# EAGLE design emc6907 (EAGLE 6.6.0)
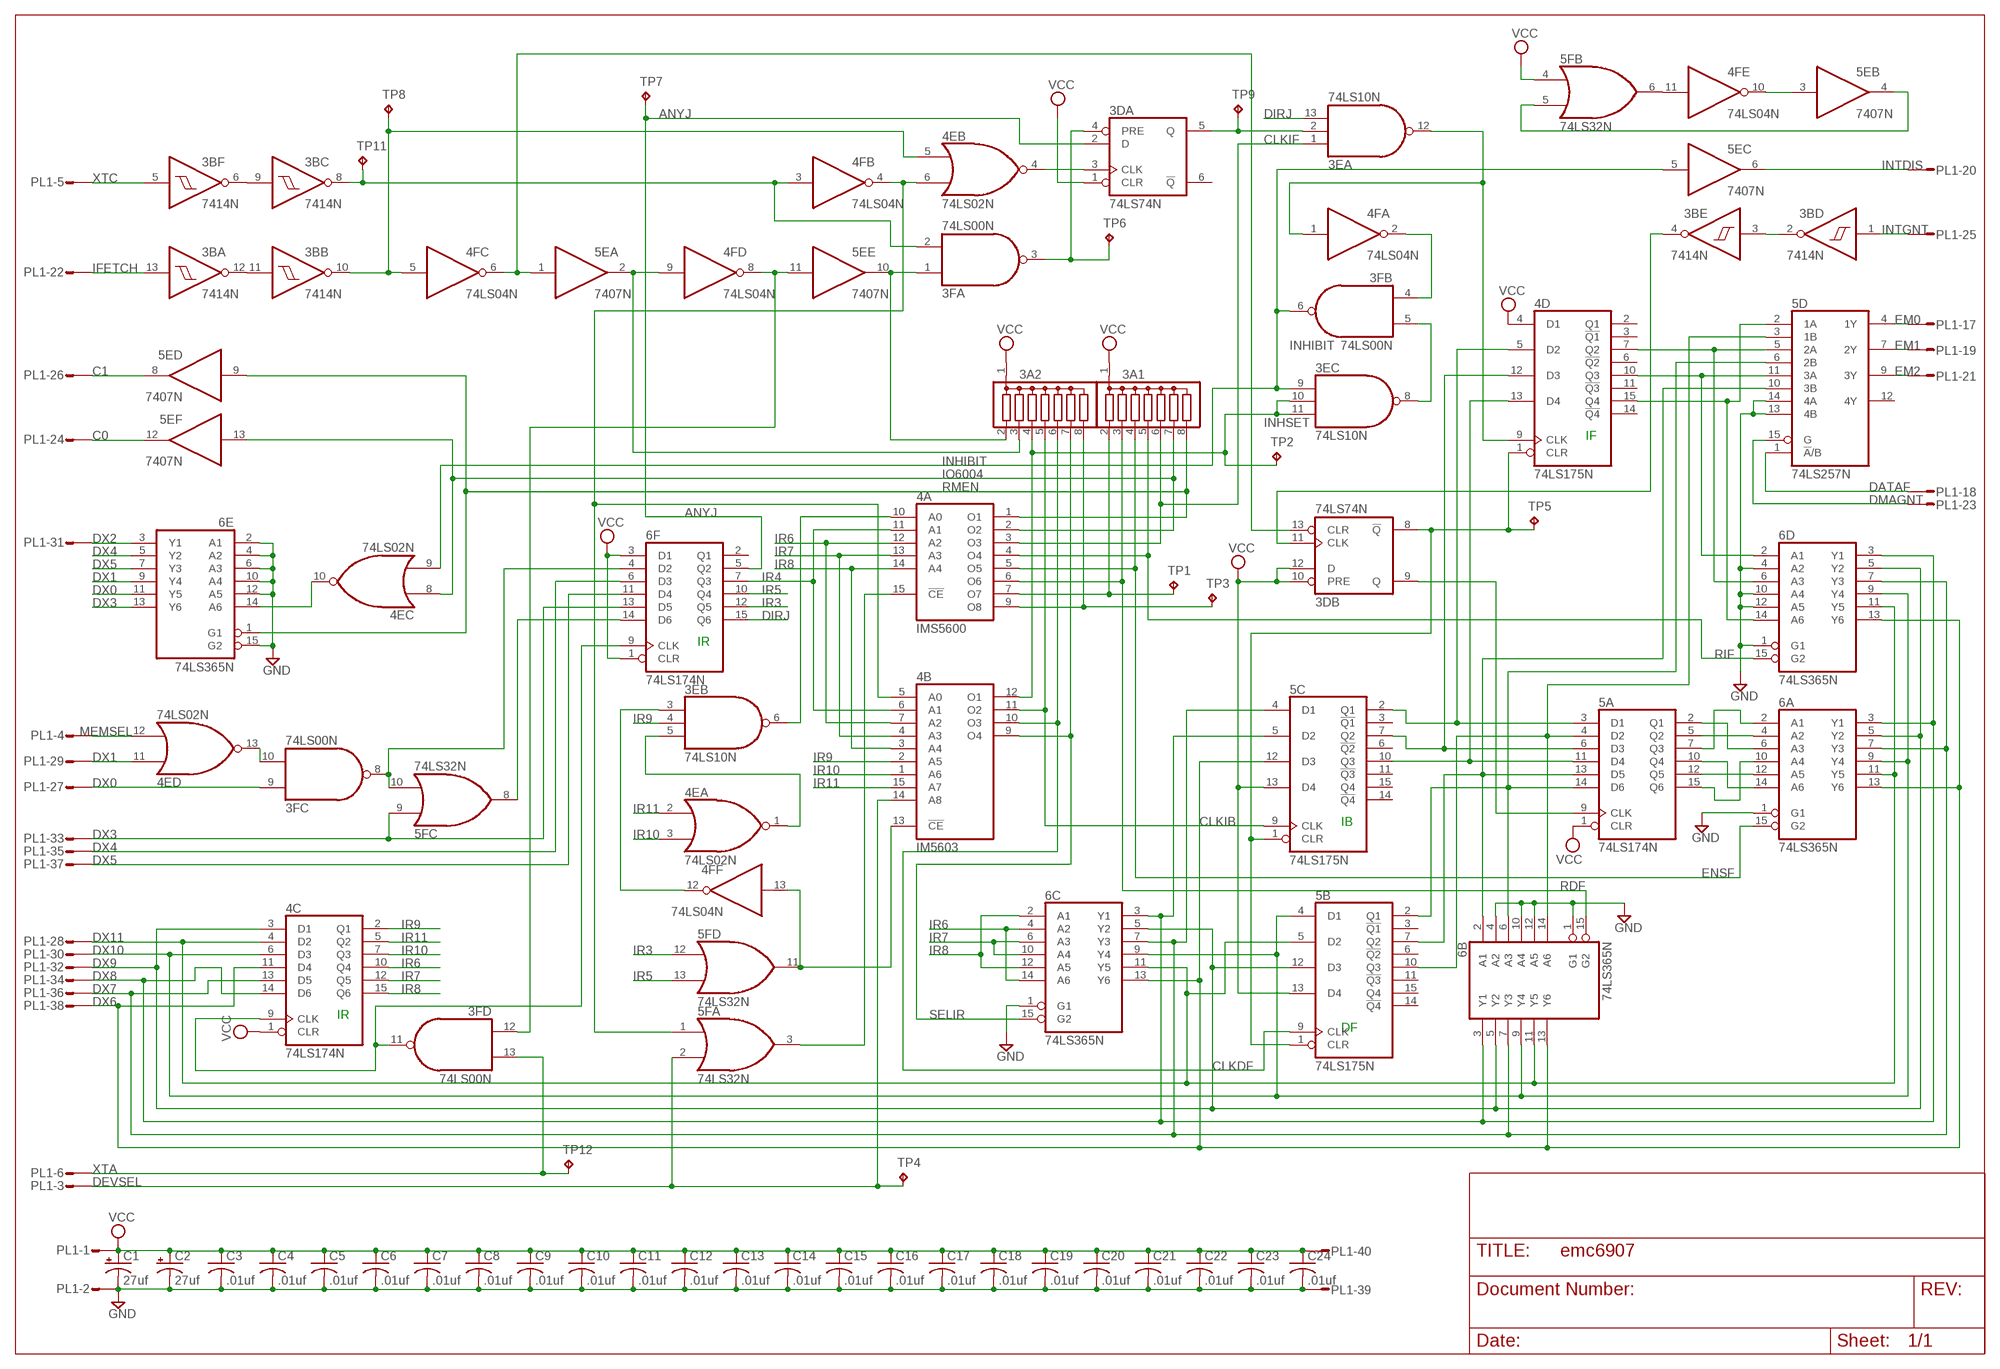
[diagram p0: schematic, sheet 1]

## Parts
3A1  G07R  [SIL8]
3A2  G07R  [SIL8]
3B  7414N  [DIL14]
3D  74LS74N  [DIL14]
3E  74LS10N  [DIL14]
3F  74LS00N  [DIL14]
4A  IMS5600  5600  [DIL16]
4B  IM5603  5306  [DIL16]
4C  74LS174N  [DIL16]
4D  74LS175N  [DIL16]
4E  74LS02N  [DIL14]
4F  74LS04N  [DIL14]
5A  74LS174N  [DIL16]
5B  74LS175N  [DIL16]
5C  74LS175N  [DIL16]
5D  74LS257N  [DIL16]
5E  7407N  [DIL14]
5F  74LS32N  [DIL14]
6A  74LS365N  [DIL16]
6B  74LS365N  [DIL16]
6C  74LS365N  [DIL16]
6D  74LS365N  [DIL16]
6E  74LS365N  [DIL16]
6F  74LS174N  [DIL16]
C1  27uf  CPOL-USE22-6AXIAL  [E22-6]
C2  27uf  CPOL-USE22-6AXIAL  [E22-6]
C3  .01uf  C-US050-025X075  [C050-025X075]
C4  .01uf  C-US050-025X075  [C050-025X075]
C5  .01uf  C-US050-025X075  [C050-025X075]
C6  .01uf  C-US050-025X075  [C050-025X075]
C7  .01uf  C-US050-025X075  [C050-025X075]
C8  .01uf  C-US050-025X075  [C050-025X075]
C9  .01uf  C-US050-025X075  [C050-025X075]
C10  .01uf  C-US050-025X075  [C050-025X075]
C11  .01uf  C-US050-025X075  [C050-025X075]
C12  .01uf  C-US050-025X075  [C050-025X075]
C13  .01uf  C-US050-025X075  [C050-025X075]
C14  .01uf  C-US050-025X075  [C050-025X075]
C15  .01uf  C-US050-025X075  [C050-025X075]
C16  .01uf  C-US050-025X075  [C050-025X075]
C17  .01uf  C-US050-025X075  [C050-025X075]
C18  .01uf  C-US050-025X075  [C050-025X075]
C19  .01uf  C-US050-025X075  [C050-025X075]
C20  .01uf  C-US050-025X075  [C050-025X075]
C21  .01uf  C-US050-025X075  [C050-025X075]
C22  .01uf  C-US050-025X075  [C050-025X075]
C23  .01uf  C-US050-025X075  [C050-025X075]
C24  .01uf  C-US050-025X075  [C050-025X075]
PL1  40VS  [40V]
TP1  TPPAD1-13  [P1-13]
TP2  TPPAD1-13  [P1-13]
TP3  TPPAD1-13  [P1-13]
TP4  TPPAD1-13  [P1-13]
TP5  TPPAD1-13  [P1-13]
TP6  TPPAD1-13  [P1-13]
TP7  TPPAD1-13  [P1-13]
TP8  TPPAD1-13  [P1-13]
TP9  TPPAD1-13  [P1-13]
TP11  TPPAD1-13  [P1-13]
TP12  TPPAD1-13  [P1-13]

## Nets
ANYJ: 3D.2(A:D) 6F.5(Q2) TP7.TP
C0: 5E.12(F:O) PL1.24
C1: 5E.8(D:O) PL1.26
CLKDF: 3A2.6 4B.10(O3) 5B.9(CLK)
CLKIB: 3A2.5 4B.11(O2) 5C.9(CLK)
CLKIF: 3A1.6 3E.1(A:I0) 4A.3(O3)
DATAF: 5D.1(!A!/B) PL1.18
DEVSEL: 4B.14(A8) 5F.2(A:I1) PL1.3 TP4.TP
DIRJ: 3E.13(A:I2) 6F.15(Q6)
DMAGNT: 5D.15(G) PL1.23
DX0: 3F.9(C:I0) 6E.11(Y5) PL1.27
DX1: 4E.11(D:I0) 6E.9(Y4) PL1.29
DX2: 6E.3(Y1) PL1.31
DX3: 5F.9(C:I0) 6E.13(Y6) 6F.13(D5) PL1.33
DX4: 6E.5(Y2) 6F.6(D3) PL1.35
DX5: 6E.7(Y3) 6F.11(D4) PL1.37
DX6: 4C.11(D4) 5C.12(D3) 6A.13(Y6) 6B.13(Y6) 6C.13(Y6) 6D.13(Y6) PL1.38
DX7: 4C.13(D5) 5C.4(D1) 6A.7(Y3) 6B.7(Y3) 6C.7(Y3) 6D.7(Y3) PL1.36
DX8: 4C.14(D6) 5C.5(D2) 6A.3(Y1) 6B.3(Y1) 6C.3(Y1) 6D.3(Y1) PL1.34
DX9: 4C.3(D1) 5B.12(D3) 6A.5(Y2) 6B.5(Y2) 6C.5(Y2) 6D.5(Y2) PL1.32
DX10: 4C.6(D3) 5B.4(D1) 6A.9(Y4) 6B.9(Y4) 6C.9(Y4) 6D.9(Y4) PL1.30
DX11: 4C.4(D2) 5B.5(D2) 6A.11(Y5) 6B.11(Y5) 6C.11(Y5) 6D.11(Y5) PL1.28
EM0: 5D.4(1Y) PL1.17
EM1: 5D.7(2Y) PL1.19
EM2: 5D.9(3Y) PL1.21
ENSF: 3A1.4 4A.5(O5) 6A.15(G2)
GND: 5D.13(4B) 5D.14(4A) 6A.1(G1) 6B.1(G1) 6B.4(A2) 6B.10(A4) 6B.12(A5) 6C.1(G1) 6D.1(G1) 6D.4(A2) 6D.10(A4) 6D.12(A5) 6E.2(A1) 6E.4(A2) 6E.6(A3) 6E.10(A4) 6E.12(A5) 6E.15(G2) C1.- C2.- C3.2 C4.2 C5.2 C6.2 C7.2 C8.2 C9.2 C10.2 C11.2 C12.2 C13.2 C14.2 C15.2 C16.2 C17.2 C18.2 C19.2 C20.2 C21.2 C22.2 C23.2 C24.2 PL1.2 PL1.39
IFETCH: 3B.13(A:I) PL1.22
INHIBIT: 3E.9(C:I0) 3F.6(B:O) 4E.9(C:I1) 5E.5(C:I)
INHSET: 3A2.4 3E.10(C:I1) 3E.11(C:I2) 4B.12(O1) TP2.TP
INTDIS: 5E.6(C:O) PL1.20
INTGNT: 3B.1(D:I) PL1.25
IO6004: 3A1.7 4A.2(O2) 4E.8(C:I0) 5E.13(F:I)
IR3: 5F.12(D:I0) 6F.12(Q5)
IR4: 4A.11(A1) 4B.6(A1) 6F.7(Q3)
IR5: 5F.13(D:I1) 6F.10(Q4)
IR6: 4A.12(A2) 4B.7(A2) 4C.10(Q4) 6C.4(A2) 6C.14(A6)
IR7: 4A.13(A3) 4B.4(A3) 4C.12(Q5) 6C.6(A3) 6C.10(A4)
IR8: 4A.14(A4) 4B.3(A4) 4C.15(Q6) 6C.2(A1) 6C.12(A5)
IR9: 3E.4(B:I1) 4B.2(A5) 4C.2(Q1)
IR10: 4B.1(A6) 4C.7(Q3) 4E.3(A:I1)
IR11: 4B.15(A7) 4C.5(Q2) 4E.2(A:I0)
LOADIR: 3F.11(D:O) 4C.9(CLK) 6F.9(CLK)
MEMSEL: 4E.12(D:I1) PL1.4
N$1: 3B.11(B:I) 3B.12(A:O)
N$2: 3B.6(F:O) 3B.9(C:I)
N$3: 3B.8(C:O) 3F.2(A:I1) 4F.3(B:I) TP11.TP
N$4: 3B.10(B:O) 4E.5(B:I0) 4F.5(C:I) TP8.TP
N$5: 3D.13(B:CLR) 4F.6(C:O) 5E.1(A:I)
N$6: 3D.5(A:Q) 3E.2(A:I1) TP9.TP
N$7: 3A2.2 3F.1(A:I0) 5E.10(E:O)
N$8: 3F.12(D:I0) 4F.8(D:O) 5E.11(E:I)
N$9: 3A2.3 4F.9(D:I) 5E.2(A:O)
N$10: 4B.5(A0) 4E.6(B:I1) 4F.4(B:O) 5F.1(A:I0)
N$11: 3D.3(A:CLK) 4E.4(B:O)
N$12: 3D.4(A:PRE) 3F.3(A:O) TP6.TP
N$13: 4F.11(E:I) 5F.6(B:O)
N$14: 3F.10(C:I1) 4E.13(D:O)
N$15: 4E.10(C:O) 6E.14(A6)
N$16: 5E.4(B:O) 5F.5(B:I1)
N$17: 4F.10(E:O) 5E.3(B:I)
N$18: 3F.8(C:O) 5F.10(C:I1) 6F.4(D2)
N$19: 5F.8(C:O) 6F.14(D6)
N$20: 4B.13(!CE) 4F.13(F:I) 5F.11(D:O)
N$28: 3A1.2 4A.7(O7) TP1.TP
N$29: 3A2.8 4A.9(O8) TP3.TP
N$35: 3E.3(B:I0) 4F.12(F:O)
N$36: 3E.6(B:O) 4A.10(A0)
N$37: 4A.15(!CE) 5F.3(A:O)
N$38: 5A.2(Q1) 6A.6(A3)
N$39: 3E.5(B:I2) 4E.1(A:O)
N$40: 5A.10(Q4) 6A.14(A6)
N$41: 5A.7(Q3) 6A.2(A1)
N$42: 5A.5(Q2) 6A.4(A2)
N$43: 5A.15(Q6) 6A.10(A4)
N$44: 5A.12(Q5) 6A.12(A5)
N$45: 4D.15(Q4) 5D.2(1A) 6D.14(A6)
N$46: 4D.10(Q3) 5D.11(3A) 6D.2(A1)
N$47: 4D.7(Q2) 5D.5(2A) 6D.6(A3)
N$48: 3D.8(B:!Q) 4D.1(CLR) 5B.1(CLR) 5C.1(CLR) TP5.TP
N$50: 4D.13(D4) 5A.11(D4) 5C.10(Q3)
N$51: 4D.5(D2) 5A.3(D1) 5C.2(Q1)
N$52: 4D.12(D3) 5A.6(D3) 5C.7(Q2)
N$53: 5A.4(D2) 5B.10(Q3) 5D.3(1B) 6B.14(A6)
N$54: 5A.14(D6) 5B.2(Q1) 5D.6(2B) 6B.6(A3)
N$55: 5A.13(D5) 5B.7(Q2) 5D.10(3B) 6B.2(A1)
N$59: 3D.9(B:Q) 5A.9(CLK)
N$61: 3E.12(A:O) 4D.9(CLK) 4F.1(A:I)
N$70: 3E.8(C:O) 3F.5(B:I1)
N$71: 3F.4(B:I0) 4F.2(A:O)
N$72: 3B.2(D:O) 3B.3(E:I)
N$74: 3B.4(E:O) 3D.11(B:CLK)
RDF: 3A1.3 4A.6(O6) 6B.15(G2)
RIF: 3A1.5 4A.4(O4) 6D.15(G2)
RMEN: 3A1.8 4A.1(O1) 5E.9(D:I) 6E.1(G1)
SELIR: 3A2.7 4B.9(O4) 6C.15(G2)
VCC: 3A1.1 3A2.1 3D.1(A:CLR) 3D.10(B:PRE) 3D.12(B:D) 4C.1(CLR) 4D.4(D1) 5A.1(CLR) 5B.13(D4) 5C.13(D4) 5F.4(B:I0) 6F.1(CLR) 6F.3(D1) C1.+ C2.+ C3.1 C4.1 C5.1 C6.1 C7.1 C8.1 C9.1 C10.1 C11.1 C12.1 C13.1 C14.1 C15.1 C16.1 C17.1 C18.1 C19.1 C20.1 C21.1 C22.1 C23.1 C24.1 PL1.1 PL1.40
XTA: 3F.13(D:I1) PL1.6 TP12.TP
XTC: 3B.5(F:I) PL1.5
Unconnected: 3D.6(A:!Q) 4D.2(Q1) 4D.3(!Q1) 4D.6(!Q2) 4D.11(!Q3) 4D.14(!Q4) 5B.3(!Q1) 5B.6(!Q2) 5B.11(!Q3) 5B.14(!Q4) 5B.15(Q4) 5C.3(!Q1) 5C.6(!Q2) 5C.11(!Q3) 5C.14(!Q4) 5C.15(Q4) 5D.12(4Y) 6F.2(Q1) PL1.7 PL1.8 PL1.9 PL1.10 PL1.11 PL1.12 PL1.13 PL1.14 PL1.15 PL1.16

## Notes on the sheet
- IF
- IR
- IB
- IR
- DF

## Power pins joined to a net without a drawn wire
GND: 3B.7(P:GND) 3D.7(P:GND) 3E.7(P:GND) 3F.7(P:GND) 4A.8(GND) 4B.8(GND) 4C.8(GND) 4D.8(GND) 4E.7(P:GND) 4F.7(P:GND) 5A.8(GND) 5B.8(GND) 5C.8(GND) 5D.8(GND) 5E.7(P:GND) 5F.7(P:GND) 6A.8(GND) 6B.8(GND) 6C.8(GND) 6D.8(GND) 6E.8(GND) 6F.8(GND)
VCC: 3B.14(P:VCC) 3D.14(P:VCC) 3E.14(P:VCC) 3F.14(P:VCC) 4A.16(VCC) 4B.16(VCC) 4C.16(VCC) 4D.16(VCC) 4E.14(P:VCC) 4F.14(P:VCC) 5A.16(VCC) 5B.16(VCC) 5C.16(VCC) 5D.16(VCC) 5E.14(P:VCC) 5F.14(P:VCC) 6A.16(VCC) 6B.16(VCC) 6C.16(VCC) 6D.16(VCC) 6E.16(VCC) 6F.16(VCC)

## Library data of the parts
3A1 3A2 = resistor-sil:G07R: SIL RESISTOR; OC_FARNELL: unknown; OC_NEWARK: unknown
3B = 74xx-us:74*14: Hex schmitt trigger INVERTER
3D = 74xx-us:74*74: Dual D type positive edge triggered FLIP FLOP, preset and clear
3E = 74xx-us:74*10: Triple 3-input NAND gate
3F = 74xx-us:74*00: Quad 2-input NAND gate
4A = memory:5600: MEMORY
4B = memory:5306: MEMORY
4C 5A 6F = 74xx-us:74*174: Hex D type FLIP FLOP, clear
4D 5B 5C = 74xx-us:74*175: Qadruple D type FLIP FLOP, clear
4E = 74xx-us:74*02: Quad 2-input NOR gate
4F = 74xx-us:74*04: Hex INVERTER
5D = 74xx-us:74*257: Quadruple 2-to 1 line data SELECTOR/MULTIPLEXER
5E = 74xx-us:74*07: Hex BUFFER, open collector high-voltage output
5F = 74xx-us:74*32: Quad 2-input OR gate
6A 6B 6C 6D 6E = 74xx-us:74*365: Hex BUS DRIVER, 3-state
C1 C2 = rcl:CPOL-US: POLARIZED CAPACITOR, American symbol
C3-C24 = rcl:C-US: CAPACITOR, American symbol
PL1 = con-harting-v:40VS: CONNECTOR; OC_FARNELL: unknown; OC_NEWARK: unknown
TP1-TP9 TP11 TP12 = testpad:TP: Test pad

## Board
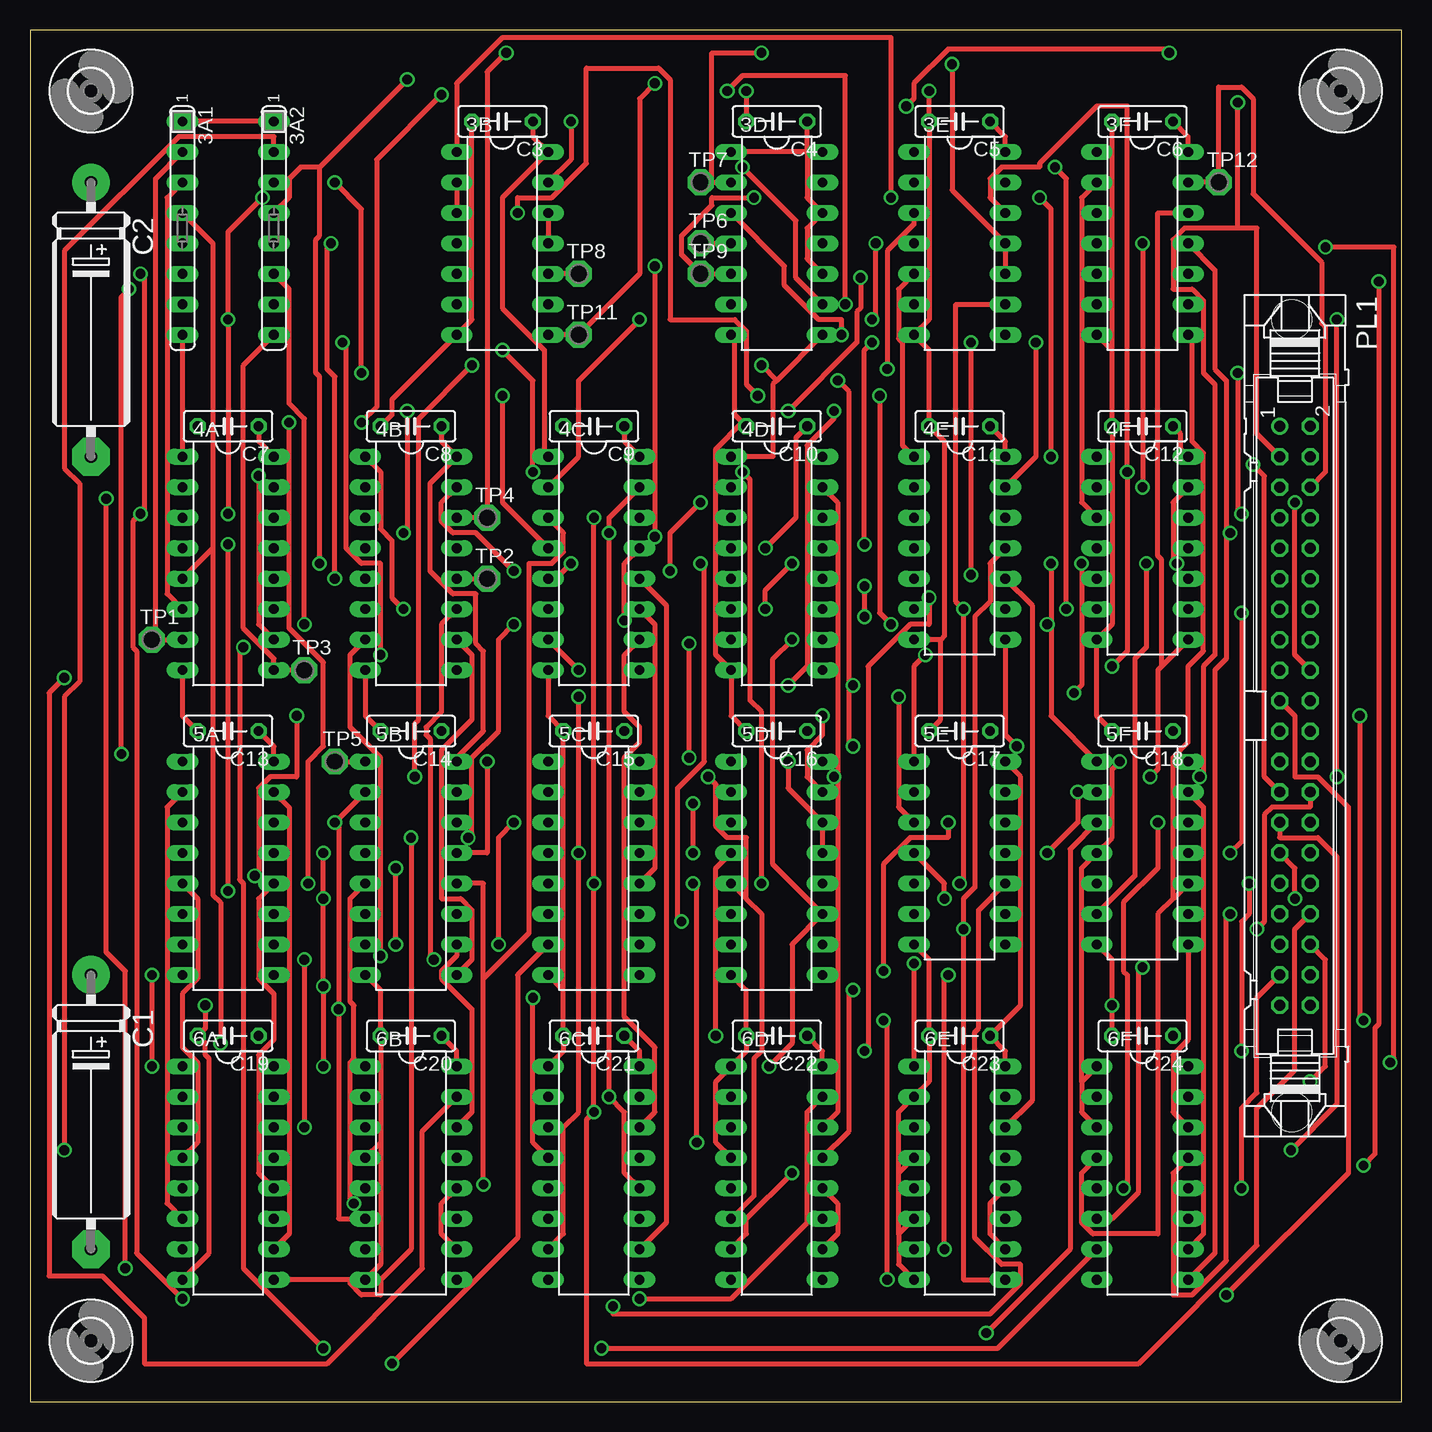
[diagram p1: board, top side]
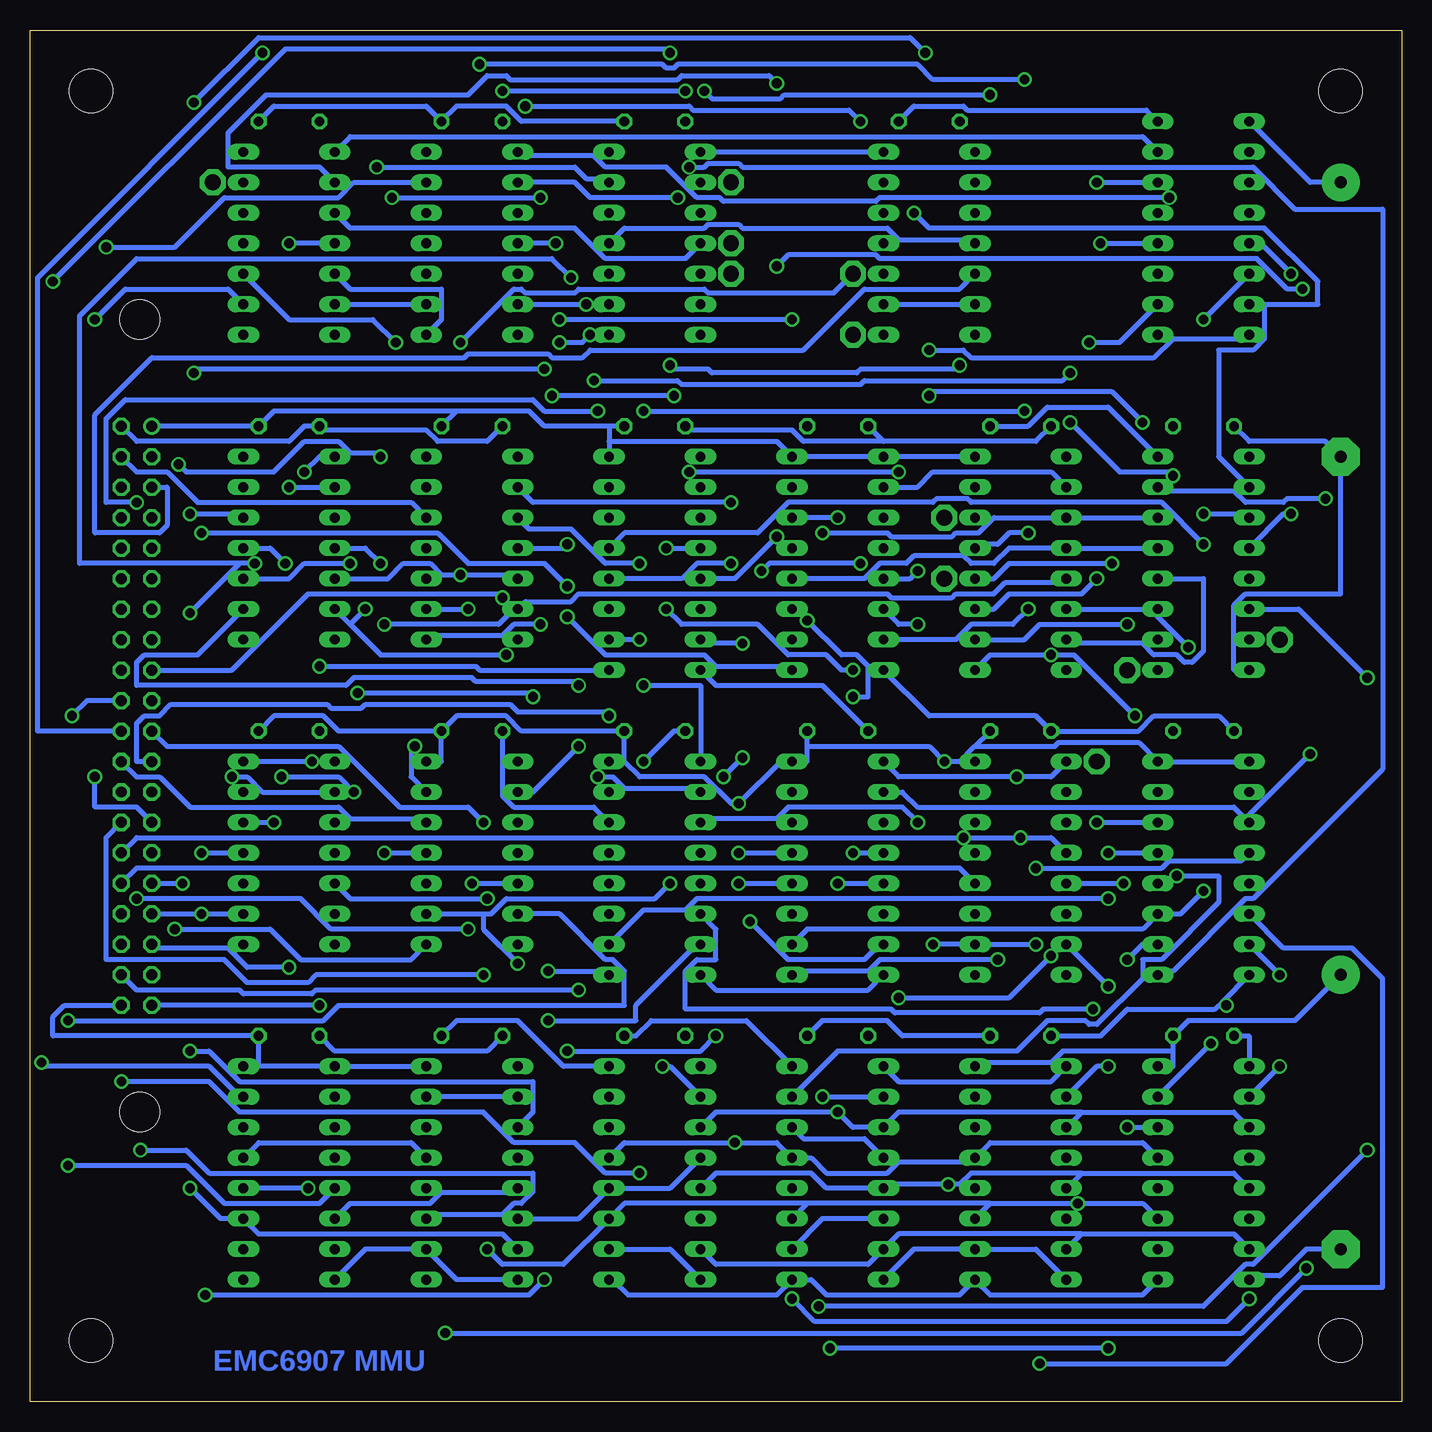
[diagram p2: board, bottom side, seen from below]

Size 114.3 x 114.3 mm. Coordinates in mm from the lower left corner, seen from the top.
Outline: 0,0 114.3,0 114.3,114.3 0,114.3 0,0
Copper layers (1+16): Top 0.035mm / dielectric 1.5mm / Bottom 0.035mm
Design rules "16mils": minimum track width 16mil, minimum drill 32mil, track to track 15mil, track to pad 10mil, pad to pad 10mil, via to via 10mil, smd to smd 10mil, copper to edge 13mil, drill to drill 10mil, minimum pad ring 10mil, minimum via ring 8mil, stop-mask expansion 0mil, vias tented up to drill 0mil, thermal gap 10mil

### Footprints (pad centres in the part's own frame; a part is rotated, then mirrored left to right if it is on the bottom)
SIL8 = drill 0.813 long: 1 -8.89,0; 2 -6.35,0; 3 -3.81,0; 4 -1.27,0; 5 1.27,0; 6 3.81,0; 7 6.35,0; 8 8.89,0
DIL14 = drill 0.813 long: 1 -7.62,-3.81; 2 -5.08,-3.81; 3 -2.54,-3.81; 4 0,-3.81; 5 2.54,-3.81; 6 5.08,-3.81; 7 7.62,-3.81; 8 7.62,3.81; 9 5.08,3.81; 10 2.54,3.81; 11 0,3.81; 12 -2.54,3.81; 13 -5.08,3.81; 14 -7.62,3.81
DIL16 = drill 0.813 long: 1 -8.89,-3.81; 2 -6.35,-3.81; 3 -3.81,-3.81; 4 -1.27,-3.81; 5 1.27,-3.81; 6 3.81,-3.81; 7 6.35,-3.81; 8 8.89,-3.81; 9 8.89,3.81; 10 6.35,3.81; 11 3.81,3.81; 12 1.27,3.81; 13 -1.27,3.81; 14 -3.81,3.81; 15 -6.35,3.81; 16 -8.89,3.81
E22-6 = drill 1.016 pad 3.15: + -11.43,0 | drill 1.016 pad 3.15 octagon: - 11.43,0
C050-025X075 = drill 0.813 octagon: 1 -2.54,0; 2 2.54,0
40V = drill 0.914: 1 -24.13,-1.27 | drill 0.914 octagon: 2 -24.13,1.27; 3 -21.59,-1.27; 4 -21.59,1.27; 5 -19.05,-1.27; 6 -19.05,1.27; 7 -16.51,-1.27; 8 -16.51,1.27; 9 -13.97,-1.27; 10 -13.97,1.27; 11 -11.43,-1.27; 12 -11.43,1.27; 13 -8.89,-1.27; 14 -8.89,1.27; 15 -6.35,-1.27; 16 -6.35,1.27; 17 -3.81,-1.27; 18 -3.81,1.27; 19 -1.27,-1.27; 20 -1.27,1.27; 21 1.27,-1.27; 22 1.27,1.27; 23 3.81,-1.27; 24 3.81,1.27; 25 6.35,-1.27; 26 6.35,1.27; 27 8.89,-1.27; 28 8.89,1.27; 29 11.43,-1.27; 30 11.43,1.27; 31 13.97,-1.27; 32 13.97,1.27; 33 16.51,-1.27; 34 16.51,1.27; 35 19.05,-1.27; 36 19.05,1.27; 37 21.59,-1.27; 38 21.59,1.27; 39 24.13,-1.27; 40 24.13,1.27 | hole 3.302: 33.02,-0.254; -33.02,-0.254
P1-13 = drill 1.321 pad 2.159 octagon: TP 0,0
3,6 = hole 3.6: 0,0

### Placement (x,y rotation side)
3A1  12.7,97.79 270 top
3A2  20.32,97.79 270 top
3B  39.37,96.52 270 top
3D  62.23,96.52 270 top
3E  77.47,96.52 270 top
3F  92.71,96.52 270 top
4A  16.51,69.85 270 top
4B  31.75,69.85 270 top
4C  46.99,69.85 270 top
4D  62.23,69.85 270 top
4E  77.47,71.12 270 top
4F  92.71,71.12 270 top
5A  16.51,44.45 270 top
5B  31.75,44.45 270 top
5C  46.99,44.45 270 top
5D  62.23,44.45 270 top
5E  77.47,45.72 270 top
5F  92.71,45.72 270 top
6A  16.51,19.05 270 top
6B  31.75,19.05 270 top
6C  46.99,19.05 270 top
6D  62.23,19.05 270 top
6E  77.47,19.05 270 top
6F  92.71,19.05 270 top
C1  5.08,24.13 270 top
C2  5.08,90.17 270 top
C3  39.37,106.68 180 top
C4  62.23,106.68 180 top
C5  77.47,106.68 180 top
C6  92.71,106.68 180 top
C7  16.51,81.28 180 top
C8  31.75,81.28 180 top
C9  46.99,81.28 180 top
C10  62.23,81.28 180 top
C11  77.47,81.28 180 top
C12  92.71,81.28 180 top
C13  16.51,55.88 180 top
C14  31.75,55.88 180 top
C15  46.99,55.88 180 top
C16  62.23,55.88 180 top
C17  77.47,55.88 180 top
C18  92.71,55.88 180 top
C19  16.51,30.48 180 top
C20  31.75,30.48 180 top
C21  46.99,30.48 180 top
C22  62.23,30.48 180 top
C23  77.47,30.48 180 top
C24  92.71,30.48 180 top
PL1  105.41,57.15 270 top
TP1  10.16,63.5 0 top
TP2  38.1,68.58 0 top
TP3  22.86,60.96 0 top
TP4  38.1,73.66 0 top
TP5  25.4,53.34 0 top
TP6  55.88,96.52 0 top
TP7  55.88,101.6 0 top
TP8  45.72,93.98 0 top
TP9  55.88,93.98 0 top
TP11  45.72,88.9 0 top
TP12  99.06,101.6 0 top
U$1  [3,6]  5.08,109.22 0 top
U$2  [3,6]  109.22,109.22 0 top
U$3  [3,6]  5.08,5.08 0 top
U$4  [3,6]  109.22,5.08 0 top

### Tracks (layer width: path | path; a pad name or v marks a point on that pad's centre or on a via)
ANYJ  (via drill 0.81)
  Top 0.406: 56.83,101.6 3D.2 | v111.12,19.68 112.08,20.64 112.08,31.11 112.39,31.43 v112.39,93.34 | v60.96,112.39 56.83,112.39 56.83,101.6 | 56.83,101.6 TP7.TP
  Bottom 0.406: 6F.5 90.17,16.51 98.11,16.51 101.28,19.68 v111.12,19.68 | v112.39,93.34 93.03,112.71 61.28,112.71 v60.96,112.39
C0
  Bottom 0.406: 5E.12 81.6,48.58 87.63,48.58 88.58,49.53 100.97,49.53 103.5,52.07 105.41,52.07 PL1.24
C1  (via drill 0.81)
  Top 0.406: v102.23,39.37 102.87,40.01 102.87,48.9 103.5,49.53 106.68,49.53 PL1.26
  Bottom 0.406: 5E.8 82.55,36.83 91.76,36.83 94.3,39.37 v102.23,39.37
CLKDF  (via drill 0.81)
  Top 0.406: 5B.9 36.83,36.83 36.83,40.96 35.88,41.91 34.29,41.91 34.29,54.29 36.83,56.83 36.83,62.23 4B.10 | 3A2.6 21.59,92.71 21.59,83.19 22.86,81.92 v22.86,64.77
  Bottom 0.406: v22.86,64.77 30.16,64.77 31.43,63.5 4B.10
CLKIB  (via drill 0.81)
  Top 0.406: v33.66,36.83 33.34,37.15 33.34,55.24 33.02,55.56 33.02,56.2 34.29,57.47 34.29,64.77 4B.11 | v25.08,96.52 24.77,96.2 24.77,86.04 25.4,85.41 v25.4,68.58
  Bottom 0.406: 5C.9 50.48,35.88 44.45,35.88 43.5,36.83 v33.66,36.83 | v25.08,96.52 3A2.5 | v25.4,68.58 26.67,67.31 32.7,67.31 33.97,66.04 4B.11
CLKIF  (via drill 0.81)
  Top 0.406: v16.51,73.98 v16.51,90.17 16.51,97.47 v19.37,100.33
  Bottom 0.406: 4A.3 13.02,73.98 v16.51,73.98 | 3A1.6 v16.51,90.17 | 3E.1 73.34,103.82 67.31,103.82 66.36,102.87 61.28,102.87 58.74,100.33 56.83,100.33 56.52,100.01 43.81,100.01 43.5,100.33 v19.37,100.33
DATAF  (via drill 0.81)
  Top 0.406: v63.18,59.69 64.77,61.28 64.77,79.69 66.99,81.92 v66.99,82.55 | v105.41,74.93 105.41,62.23 PL1.18
  Bottom 0.406: 5D.1 58.42,59.69 v63.18,59.69 | v66.99,82.55 71.44,82.55 72.39,83.5 106.36,83.5 107.95,81.92 107.95,74.93 v105.41,74.93
DEVSEL  (via drill 0.81)
  Top 0.406: 4B.14 TP4.TP 38.1,110.81 v39.69,112.39 | v97.47,52.07 97.79,52.39 97.79,61.28 98.74,62.23 98.74,84.77 97.79,85.72 97.79,91.76 96.84,92.71 95.25,92.71 95.25,96.84 96.2,97.79 100.65,97.79 | 100.65,97.79 102.23,97.79 102.23,80.64 PL1.3 | 100.65,97.79 v100.65,108.27
  Bottom 0.406: 5F.2 94.93,50.8 96.2,52.07 v97.47,52.07 | v39.69,112.39 40.96,113.67 95.25,113.67 v100.65,108.27
DIRJ  (via drill 0.81)
  Top 0.406: v107.95,96.2 113.67,96.2 113.67,28.57 v113.35,28.26
  Bottom 0.406: 3E.13 87.31,101.6 88.58,100.33 98.11,100.33 102.23,96.2 v107.95,96.2 | v113.35,28.26 113.03,27.94 99.38,27.94 96.84,25.4 6F.15
DMAGNT  (via drill 0.81)
  Top 0.406: 5D.15 64.77,52.07 64.77,54.29 66.04,55.56 v66.04,57.15
  Bottom 0.406: v66.04,57.15 66.36,57.47 73.66,57.47 74.3,58.1 86.36,58.1 86.68,57.78 89.22,57.78 89.53,58.1 102.55,58.1 103.5,57.15 104.78,57.15 105.41,56.52 105.41,53.34 PL1.23
DX0  (via drill 0.81)
  Top 0.406: v105.09,20.95 108.9,24.77 108.9,45.4 107.31,46.99 104.14,46.99 PL1.27 | v108.9,52.07 v108.9,90.17
  Bottom 0.406: 6E.11 80.96,15.56 74.93,15.56 73.98,16.51 73.34,16.51 72.39,17.46 72.39,19.05 99.38,19.05 101.28,20.95 v105.09,20.95 | 3F.9 97.79,92.71 106.36,92.71 v108.9,90.17 | v108.9,52.07 108.9,49.53 105.41,49.53 PL1.27
DX1  (via drill 0.81)
  Top 0.406: 6E.9 77.79,10.16 v77.79,39.37 77.79,41.91 78.74,42.86 78.74,65.41 80.01,66.67 80.01,69.85 4E.11 | PL1.29 105.41,44.45 v105.41,41.91
  Bottom 0.406: v105.41,41.91 91.76,41.91 89.22,39.37 v77.79,39.37
DX2  (via drill 0.81)
  Top 0.406: v100.97,29.21 100.97,40.01 101.6,40.64 v101.6,43.18
  Bottom 0.406: 6E.3 72.39,24.13 72.39,26.67 96.84,26.67 99.38,29.21 v100.97,29.21 | PL1.31 v101.6,43.18
DX3  (via drill 0.81)
  Top 0.406: v100.01,40.64 99.69,40.32 99.69,11.75 96.84,8.89 95.25,8.89 95.25,19.05 6F.13
  Bottom 0.406: PL1.33 v100.01,40.64 5F.9 | 6E.13 82.55,21.59 95.25,21.59 6F.13
DX4  (via drill 0.81)
  Top 0.406: v92.71,36.2 92.39,35.88 92.39,17.46 90.17,15.24 6F.6
  Bottom 0.406: 6E.5 73.98,17.46 80.01,17.46 80.96,16.51 87.63,16.51 6F.6 | PL1.35 103.82,37.78 97.79,37.78 96.2,36.2 v92.71,36.2
DX5  (via drill 0.81)
  Top 0.406: PL1.37 102.23,33.66 102.23,25.72 100.97,24.45 v100.97,17.78
  Bottom 0.406: 6E.7 74.93,13.97 95.25,13.97 6F.11 98.42,15.24 v100.97,17.78
DX6  (via drill 0.81)
  Top 0.406: 5C.12 52.07,44.45 52.07,64.77 4C.11 | v68.58,34.29 68.26,33.97 68.26,22.54 6D.13 | v55.24,43.18 55.56,42.86 v55.56,21.59
  Bottom 0.406: 6A.13 21.59,21.59 34.29,21.59 6B.13 35.88,20 41.91,20 42.86,19.05 47.94,19.05 49.21,20.32 6C.13 52.07,21.59 v55.56,21.59 64.77,21.59 6D.13 | PL1.38 105.41,34.29 96.84,34.29 96.52,33.97 90.81,33.97 90.49,34.29 v68.58,34.29 | v55.24,43.18 5C.12
DX7  (via drill 0.81)
  Top 0.406: 6C.7 44.45,13.97 44.45,22.86 45.72,24.13 v45.72,45.72 v45.72,58.74 | 4C.13 49.53,69.85 v49.53,65.09 | PL1.36 107.95,36.83 107.95,27.94 v106.68,26.67 | v63.5,19.05 59.69,15.24 59.69,13.97 6D.7
  Bottom 0.406: 6A.7 13.97,13.97 26.67,13.97 | 6B.7 26.67,13.97 | 26.67,13.97 41.91,13.97 6C.7 44.45,11.43 57.15,11.43 6D.7 | v45.72,45.72 5C.4 | v49.53,65.09 46.67,62.23 45.4,62.23 44.45,61.28 44.45,58.74 v45.72,58.74 | v106.68,26.67 99.38,26.67 96.84,24.13 76.52,24.13 73.98,21.59 68.9,21.59 66.36,19.05 v63.5,19.05
DX8  (via drill 0.81)
  Top 0.406: v46.99,73.66 v46.99,43.18 v46.99,24.13 46.35,23.5 46.35,3.17 92.39,3.17 102.23,13.02 102.23,24.45 105.41,27.62 105.41,39.37 PL1.34
  Bottom 0.406: 6A.3 13.97,24.13 26.67,24.13 | 6B.3 26.67,24.13 | 26.67,24.13 41.91,24.13 6C.3 45.72,22.86 v46.99,24.13 57.15,24.13 6D.3 | v46.99,43.18 5C.5 | v46.99,73.66 4C.14
DX9  (via drill 0.81)
  Top 0.406: 5B.12 37.78,43.18 37.78,35.24 | v37.78,18.1 37.78,35.24 | 4C.3 44.45,72.39 44.45,70.8 43.5,69.85 41.59,69.85 41.59,39.05 37.78,35.24
  Bottom 0.406: 6A.5 13.97,19.05 26.67,19.05 | 6B.5 26.67,19.05 | 26.67,19.05 35.88,19.05 36.83,18.1 v37.78,18.1 42.86,18.1 6C.5 47.94,17.78 49.21,19.05 57.15,19.05 6D.5 | PL1.32 105.41,44.45 36.83,44.45 5B.12
DX10  (via drill 0.81)
  Top 0.406: v40.32,64.77 39.05,63.5 39.05,55.88 36.83,53.66 36.83,47.31 v36.51,46.99 | 6A.9 26.67,10.16 26.67,9.84 27.62,8.89 29.21,8.89 29.21,10.16 31.75,12.7 v31.75,46.99
  Bottom 0.406: 6A.9 21.59,8.89 34.29,8.89 6B.9 36.83,8.89 47.94,8.89 49.21,10.16 6C.9 52.07,8.89 64.45,8.89 65.72,10.16 6D.9 | 5B.4 29.21,46.99 v31.75,46.99 v36.51,46.99 105.41,46.99 PL1.30 | 4C.6 41.91,64.77 v40.32,64.77
DX11  (via drill 0.81)
  Top 0.406: 5B.5 26.67,41.91 26.67,33.34 26.99,33.02 26.99,28.57 26.67,28.26 26.67,16.83 v26.99,16.51 | 4C.4 39.37,74.93 v39.37,83.82 | v21.59,81.6 21.59,64.45 24.45,61.59 24.45,54.61 23.18,53.34 v23.18,43.18 | v76.52,35.56 76.2,35.24 v76.2,12.7
  Bottom 0.406: 6A.11 21.59,16.51 v26.99,16.51 34.29,16.51 | 6B.11 34.29,16.51 | 49.53,16.51 6C.11 | 34.29,16.51 49.53,16.51 | 49.53,16.51 64.77,16.51 6D.11 69.85,11.43 74.93,11.43 v76.2,12.7 | v39.37,83.82 39.05,84.14 24.13,84.14 v21.59,81.6 | 5B.5 v23.18,43.18 | PL1.28 107.95,46.99 107.95,36.83 98.11,36.83 96.2,34.92 91.12,34.92 90.49,35.56 v76.52,35.56
EM0  (via drill 0.81)
  Top 0.406: 5D.4 57.15,44.45 v57.15,30.48 | v69.53,29.21 69.85,29.53 69.85,61.28 73.34,64.77 74.93,64.77 v74.93,66.99
  Bottom 0.406: v57.15,30.48 58.42,29.21 v69.53,29.21 | v74.93,66.99 75.25,67.31 91.12,67.31 97.47,60.96 PL1.17
EM1  (via drill 0.81)
  Top 0.406: v71.12,31.75 71.44,31.43 v71.44,10.16 | v99.69,8.89 109.86,19.05 109.86,49.53 107.31,52.07 105.41,52.07 105.41,57.15 PL1.19
  Bottom 0.406: 5D.7 58.74,37.78 59.05,37.78 63.82,33.02 63.82,31.75 v71.12,31.75 | v71.44,10.16 72.71,8.89 v99.69,8.89
EM2  (via drill 0.81)
  Top 0.406: v71.12,35.88 71.12,44.77 73.34,46.99 76.52,46.99 v76.52,48.26
  Bottom 0.406: 5D.9 66.36,35.88 v71.12,35.88 | v76.52,48.26 77.79,49.53 83.5,49.53 88.58,54.61 102.87,54.61 PL1.21
ENSF  (via drill 0.81)
  Top 0.406: 15.24,71.12 4A.5 | 15.24,71.12 15.24,96.52 3A1.4 | v15.88,29.84 15.88,41.59 15.24,42.23 15.24,71.12
  Bottom 0.406: v15.88,29.84 6A.15
GND  (via drill 0.81)
  Top 0.406: C18.2 88.9,57.15 4F.7 90.17,64.77 C12.2 90.17,87.63 | 90.17,87.63 3F.7 | 90.17,87.63 C6.2 | 5D.13 5D.14 63.18,51.12 v63.18,53.34 | 75.88,63.5 4E.7 | 75.88,63.5 75.88,56.83 C17.2 | v59.69,109.22 C4.2 | v74.93,109.22 C5.2 74.93,90.17 3E.7 74.93,87.63 C11.2 76.2,80.01 76.2,63.82 75.88,63.5 | 3D.7 58.74,88.58 58.74,82.23 59.37,81.6 | C8.2 30.16,82.23 30.16,83.5 3B.7 36.83,90.17 C3.2 | 4C.8 43.18,57.15 C15.2 44.45,34.29 | C16.2 58.42,57.15 4D.8 57.15,62.23 57.15,79.38 59.37,81.6 | C13.2 12.7,57.15 4A.8 | C14.2 27.94,57.15 4B.8 | 59.37,81.6 C10.2 | 6A.8 14.92,12.38 14.92,28.57 14.61,28.89 14.61,29.84 C19.2 14.61,31.11 v14.61,33.02 | 6B.12 34.29,16.51 34.29,13.97 6B.10 | 29.21,21.59 6B.4 | 29.21,27.94 C20.2 29.21,34.29 5B.8 | 29.21,27.94 29.21,21.59 | 29.21,27.94 6B.1 | 6B.8 29.21,11.43 29.21,21.59 | 6C.1 44.45,29.21 C21.2 44.45,34.29 | 44.45,34.29 5C.8 | 5D.8 59.69,34.29 C22.2 59.69,29.21 6D.1 57.15,26.67 57.15,21.59 6D.4 | 5F.7 90.17,36.83 v90.17,33.02 C24.2 | 5E.7 74.93,36.83 C23.2 74.93,26.67 6E.2 72.39,24.13 72.39,19.05 | 6E.8 72.39,11.43 72.39,13.97 | 6E.6 72.39,13.97 | 72.39,19.05 6E.4 | 72.39,13.97 72.39,19.05 | 6E.12 80.01,16.51 80.01,13.97 6E.10 | 6D.10 67.31,13.97 67.31,16.51 6D.12
  Bottom 0.406: PL1.2 105.41,80.01 92.71,80.01 91.44,81.28 C12.2 89.85,80.96 81.28,80.96 80.33,80.01 76.2,80.01 C11.2 | 5D.14 67.31,49.53 73.98,49.53 74.93,50.48 C17.2 | v74.93,109.22 v59.69,109.22 | 43.18,80.01 C9.2 | 43.18,80.01 30.48,80.01 C8.2 | C10.2 59.37,80.96 50.8,80.96 49.85,80.01 43.18,80.01 | C15.2 48.26,59.69 57.15,59.69 4D.8 | C7.2 12.7,80.01 6.35,80.01 C2.- 5.08,67.31 13.02,67.31 13.97,66.36 13.97,60.96 4A.8 | C13.2 15.24,57.15 20.64,57.15 21.91,55.88 C14.2 30.48,57.15 39.37,57.15 4C.8 | 6A.1 12.7,30.48 C19.2 | 6A.8 12.38,10.48 10.16,10.48 7.94,12.7 C1.- | 6B.8 30.48,12.7 6B.10 40.64,12.7 6C.8 | 14.92,33.34 15.56,32.7 22.86,32.7 25.08,30.48 C20.2 | 14.92,33.34 5A.8 | 14.92,33.34 v14.61,33.02 | 5C.8 44.45,34.29 57.15,34.29 5D.8 | v90.17,33.02 PL1.39 | 6E.2 6E.15 | 6D.8 60.96,12.7 6D.10 | 6E.6 68.58,15.24 6D.12 60.96,17.78 6D.4 | 6E.8 78.74,10.16 6E.10 86.36,12.7 6F.8 | C24.2 88.9,29.21 76.2,29.21 C23.2 | 6B.1 29.21,26.67 41.91,26.67 6C.1 | v63.18,53.34 60.64,55.88 C16.2
IFETCH  (via drill 0.81)
  Top 0.406: 3B.13 45.09,103.5 v45.09,106.68 | v73.03,107.95 73.66,108.58 73.66,109.86 76.52,112.71 94.93,112.71 v94.93,112.39
  Bottom 0.406: v45.09,106.68 46.04,107.63 59.05,107.63 59.37,107.95 v73.03,107.95 | v94.93,112.39 113.67,93.66 113.67,55.88 PL1.22
INHIBIT  (via drill 0.81)
  Top 0.406: v77.47,43.18 77.79,43.5 v77.79,66.04 77.15,66.67 77.15,91.44 3E.9
  Bottom 0.406: 3F.6 3E.9 | v77.47,43.18 5E.5 | 4E.9 v77.79,66.04
INHSET  (via drill 0.81)
  Top 0.406: 3E.10 3E.11 76.83,100.97 v76.83,111.44 | 3A2.4 21.59,100.33 21.59,101.92 22.54,102.87 24.13,102.87 | 24.13,102.87 24.13,97.16 23.81,96.84 23.81,85.72 24.13,85.41 v24.13,69.85 | 24.13,102.87 v31.43,110.17 | 4B.12 TP2.TP
  Bottom 0.406: v24.13,69.85 32.7,69.85 33.97,68.58 4B.12 | v76.83,111.44 61.59,111.44 61.28,111.12 60.64,111.12 60.33,111.44 40.32,111.44 39.05,110.17 v31.43,110.17
INTDIS  (via drill 0.81)
  Top 0.406: v111.12,31.75 110.81,32.07 v110.81,57.15
  Bottom 0.406: 5E.6 70.17,40.64 66.36,36.83 65.72,36.83 64.77,35.88 64.77,33.02 88.58,33.02 89.85,31.75 v111.12,31.75 | v110.81,57.15 109.54,58.42 PL1.20
INTGNT  (via drill 0.81)
  Top 0.406: 3B.1 35.56,109.86 39.37,113.67 71.75,113.67 v71.75,100.33 | v84.14,100.33 85.09,99.38 v85.09,78.74 | v101.92,78.11 102.87,77.15 102.87,52.07 PL1.25
  Bottom 0.406: v84.14,100.33 v71.75,100.33 | v85.09,78.74 85.41,79.06 87.63,79.06 88.58,80.01 91.44,80.01 93.98,77.47 101.28,77.47 v101.92,78.11
IO6004  (via drill 0.81)
  Top 0.406: v82.23,54.61 81.28,55.56 4E.8 | v71.75,64.77 70.8,65.72 v70.8,83.82 | v60.64,83.82 59.69,84.77 59.69,89.22 58.74,90.17 53.34,90.17 53.34,110.17 52.39,111.12 46.35,111.12 46.35,103.19 43.5,100.33 40.64,100.33 v40.64,99.06
  Bottom 0.406: 5E.13 82.55,52.07 82.55,54.61 v82.23,54.61 | 4A.2 15.24,78.74 15.24,87.63 12.38,87.63 11.43,88.58 11.43,91.44 | 3A1.7 11.43,91.44 | 4E.8 80.96,63.82 74.93,63.82 73.98,64.77 v71.75,64.77 | v60.64,83.82 v70.8,83.82 | v40.64,99.06 39.37,97.79 11.43,97.79 6.99,93.34 6.99,91.44 11.43,91.44
IR3  (via drill 0.81)
  Top 0.406: v91.12,17.78 91.44,18.1 91.44,35.56 91.12,35.88 91.12,41.59 93.98,44.45 v93.98,48.26
  Bottom 0.406: v91.12,17.78 6F.12 | 5F.12 v93.98,48.26
IR4  (via drill 0.81)
  Top 0.406: 6F.7 80.64,4.45 v47.62,4.45 | v24.45,4.45 17.78,11.11 17.78,43.18 17.46,43.5 17.46,62.55 v17.78,62.87
  Bottom 0.406: 4B.6 20.95,66.04 | v24.45,4.45 v47.62,4.45 | 20.95,66.04 v17.78,62.87 | 20.95,66.04 4A.11
IR5
  Top 0.406: 6F.10 97.79,13.97 97.79,49.53 5F.13
IR6  (via drill 0.81)
  Top 0.406: 4C.10 49.53,62.23 49.53,57.47 50.8,56.2 50.8,54.93 49.53,53.66 49.53,32.07 52.07,29.53 52.07,24.13 6C.14 | 4B.7 26.67,62.23 26.67,56.2 29.21,53.66 v29.21,37.15 | v41.91,33.66 41.91,21.59 6C.4
  Bottom 0.406: 4B.7 27.62,63.18 21.59,63.18 20.64,62.23 18.73,62.23 18.1,61.59 17.46,61.59 16.51,62.55 16.51,68.58 4A.12 | 6C.4 44.77,21.91 49.85,21.91 6C.14 | v29.21,37.15 32.7,33.66 v41.91,33.66
IR7
  Top 0.406: 6C.10 53.02,14.92 53.02,66.36 4C.12
  Bottom 0.406: 6C.10 48.26,15.24 6C.6 | 4C.12 44.77,68.58 43.5,69.85 41.27,69.85 40.64,70.48 36.51,70.48 35.88,69.85 33.97,69.85 32.7,71.12 4B.4 4A.13
IR8  (via drill 0.81)
  Top 0.406: 6C.12 49.53,19.05 49.53,24.13 v48.26,25.4 v48.26,72.39 48.26,73.66 4C.15
  Bottom 0.406: 4A.14 4B.3 33.97,73.66 35.24,72.39 37.15,72.39 37.47,72.07 42.55,72.07 42.86,72.39 v48.26,72.39 | v48.26,25.4 6C.2
IR9  (via drill 0.81)
  Top 0.406: v70.48,96.52 70.48,90.49 v70.17,90.17 | v50.8,90.17 45.72,85.09 45.72,78.74 4C.2
  Bottom 0.406: 4B.2 29.21,77.47 39.05,77.47 40.32,76.2 4C.2 | v70.48,96.52 3E.4 | v50.8,90.17 v70.17,90.17
IR10  (via drill 0.81)
  Top 0.406: v31.11,66.04 30.16,66.99 30.16,71.75 29.21,72.71 29.21,77.47 4B.1 | v63.5,69.85 61.28,67.63 v61.28,66.04 | 4C.7 v45.72,60.96
  Bottom 0.406: 4C.7 37.15,63.5 35.88,64.77 32.38,64.77 v31.11,66.04 | 4E.3 72.71,72.71 69.22,72.71 66.36,69.85 v63.5,69.85 | v61.28,66.04 60.01,64.77 53.66,64.77 51.12,62.23 47.94,62.23 46.67,60.96 v45.72,60.96
IR11  (via drill 0.81)
  Top 0.406: 4B.15 34.29,74.93 34.29,73.34 35.24,72.39 37.15,72.39 v40.32,69.22 | v55.88,74.93 53.34,72.39 v53.34,69.22 | v45.09,69.85 43.81,68.58 4C.5
  Bottom 0.406: v40.32,69.22 40.96,68.58 4C.5 | 4E.2 72.39,74.93 v55.88,74.93 | v53.34,69.22 52.7,69.85 v45.09,69.85
LOADIR  (via drill 0.81)
  Top 0.406: 6F.9 98.74,12.38 98.74,60.96 99.69,61.91 99.69,72.39 | 99.69,72.39 99.69,85.09 98.74,86.04 98.74,94.3 3F.11 | v69.53,67.94 v69.53,65.41 | 99.69,72.39 v100.01,72.39
  Bottom 0.406: 4C.9 51.12,61.28 57.15,61.28 58.1,62.23 66.36,62.23 v69.53,65.41 | v69.53,67.94 71.44,69.85 77.79,69.85 80.33,72.39 v100.01,72.39
MEMSEL
  Bottom 0.406: 4E.12 82.55,74.93 100.33,74.93 102.87,77.47 105.41,77.47 PL1.4
N$1
  Top 0.406: 3B.12 3B.11
N$2
  Bottom 0.406: 3B.9 3B.6
N$3  (via drill 0.81)
  Top 0.406: 3B.8 TP11.TP 50.8,93.98 50.8,108.58 v52.07,109.86 | 4F.3 87.63,74.93 87.63,100.33 3F.2
  Bottom 0.406: v52.07,109.86 52.7,110.49 60.01,110.49 60.33,110.17 74.3,110.17 74.61,110.49 76.2,110.49 77.79,108.9 94.61,108.9 97.79,105.73 97.79,102.87 90.17,102.87 3F.2
N$4  (via drill 0.81)
  Top 0.406: TP8.TP 3B.10 | v78.42,68.9 v78.42,88.27
  Bottom 0.406: 4E.5 73.98,68.9 v78.42,68.9 80.01,68.9 80.96,69.85 83.19,69.85 84.45,68.58 4F.5 | TP8.TP 47.31,92.39 57.78,92.39 58.1,92.71 68.58,92.71 68.9,92.39 73.03,92.39 73.34,92.71 73.98,92.71 v78.42,88.27
N$5  (via drill 0.81)
  Top 0.406: 5E.1 73.66,61.28 v74.61,62.23 | v85.41,102.87 86.36,101.92 v86.36,66.04
  Bottom 0.406: v74.61,62.23 85.09,62.23 87.63,64.77 | 4F.6 87.63,64.77 | 3D.13 66.36,101.92 67.94,101.92 68.9,102.87 v85.41,102.87 | 87.63,64.77 v86.36,66.04
N$6  (via drill 0.81)
  Top 0.406: 3D.5 TP9.TP 54.29,95.57 54.29,97.16 56.83,99.69 56.83,100.33 v60.33,100.33
  Bottom 0.406: 3E.2 68.9,101.6 67.63,100.33 v60.33,100.33
N$7  (via drill 0.81)
  Top 0.406: 5E.10 79.06,40.96 79.06,31.11 78.74,30.8 78.74,13.65 80.96,11.43 82.55,11.43 82.55,9.84 80.01,7.3 48.58,7.3 v48.58,7.94 | v2.86,20.95 2.86,58.74 4.13,60.01 4.13,76.52 2.86,77.79 2.86,95.89 12.38,105.41 20.32,105.41 3A2.2
  Bottom 0.406: 3A2.2 21.59,105.41 87.63,105.41 3F.1 | v48.58,7.94 16.51,7.94 13.02,11.43 12.38,11.43 v2.86,20.95
N$8  (via drill 0.81)
  Top 0.406: v84.77,45.72 87.31,48.26 v87.31,50.8 | v93.34,52.07 93.98,52.7 93.98,60.96 94.3,61.28 | 4F.8 94.3,61.28 | 3F.12 93.98,99.06 93.98,70.48 94.3,70.17 94.3,61.28
  Bottom 0.406: v84.77,45.72 5E.11 | v87.31,50.8 88.58,52.07 v93.34,52.07
N$9  (via drill 0.81)
  Top 0.406: v25.4,101.6 27.62,99.38 v27.62,85.72 | v67.31,85.09 68.26,84.14 68.26,59.69 | 68.26,59.69 68.26,54.93 v68.58,54.61 | 68.26,59.69 v68.58,59.69
  Bottom 0.406: v25.4,101.6 3A2.3 | v27.62,85.72 28.26,85.09 44.77,85.09 45.09,84.77 60.01,84.77 60.33,85.09 v67.31,85.09 | v68.58,54.61 72.39,50.8 5E.2 | 4F.9 100.33,62.23 104.78,62.23 105.41,61.59 105.41,59.69 87.95,59.69 87.31,60.33 77.47,60.33 77.15,60.01 68.9,60.01 v68.58,59.69
N$10  (via drill 0.81)
  Top 0.406: 5F.1 85.09,57.15 85.09,64.77 | v85.09,69.85 85.09,64.77 | v84.77,64.77 85.09,64.77
  Bottom 0.406: v85.09,69.85 86.36,71.12 4F.4 | 4B.5 28.26,68.26 33.02,68.26 33.97,67.31 37.15,67.31 37.47,66.99 42.55,66.99 42.86,67.31 68.58,67.31 69.22,66.67 73.03,66.67 4E.6 73.98,66.04 75.25,64.77 v84.77,64.77
N$11  (via drill 0.81)
  Top 0.406: 3D.3 62.87,94.61 62.87,93.03 65.72,90.17 67.63,90.17 v67.63,88.9 | v70.17,88.27 69.53,87.63 v69.53,71.44
  Bottom 0.406: v67.63,88.9 68.26,88.27 v70.17,88.27 | v69.53,71.44 69.85,71.12 4E.4
N$12
  Top 0.406: TP6.TP 3D.4
  Bottom 0.406: 3F.3 87.63,97.79 68.9,97.79 66.36,95.25 59.69,95.25 3D.4
N$13  (via drill 0.81)
  Top 0.406: 5F.6 92.08,43.81 92.08,61.91 93.03,62.87 v93.03,69.85
  Bottom 0.406: v93.03,69.85 94.3,71.12 4F.11
N$14  (via drill 0.81)
  Top 0.406: 4E.13 83.82,78.74 v83.82,88.27
  Bottom 0.406: v83.82,88.27 85.72,90.17 92.71,90.17 3F.10
N$15
  Top 0.406: 6E.14 83.5,25.08 83.5,66.36 4E.10
N$16  (via drill 0.81)
  Top 0.406: 5E.4 76.2,43.18 v76.2,41.91
  Bottom 0.406: v76.2,41.91 87.63,41.91 5F.5
N$17  (via drill 0.81)
  Top 0.406: 5E.3 72.39,49.53 v72.39,58.74 | v87,59.05 87.63,59.69 v87.63,69.85
  Bottom 0.406: v72.39,58.74 72.71,59.05 v87,59.05 | v87.63,69.85 91.44,69.85 92.71,68.58 4F.10
N$18
  Top 0.406: 6F.4 87.63,19.05 87.63,14.92 88.58,13.97 93.98,13.97 93.98,40.64 95.25,41.91 | 5F.10 95.25,41.91 | 3F.8 96.84,88.58 96.84,80.01 97.79,79.06 97.79,62.55 96.52,61.28 96.52,54.93 95.25,53.66 95.25,41.91
N$19
  Top 0.406: 6F.14 95.25,24.13 95.25,28.89 96.52,30.16 5F.8
N$20  (via drill 0.81)
  Top 0.406: v100.01,45.72 100.97,46.67 v100.97,65.72 | v95.57,69.85 95.25,70.17 95.25,74.93 4F.13 | v31.11,72.39 31.43,72.71 v31.43,82.55 | v63.18,82.55 68.9,88.27 68.9,90.81 69.22,91.12 v69.22,93.66
  Bottom 0.406: v100.01,45.72 5F.11 | 96.84,69.85 v100.97,65.72 | v95.57,69.85 96.84,69.85 | 4B.13 35.24,71.44 33.66,71.44 32.7,72.39 v31.11,72.39 | v63.18,82.55 v31.43,82.55 | v69.22,93.66 70.8,95.25 105.41,95.25 110.17,90.49 110.17,69.85 96.84,69.85
N$28
  Top 0.406: 10.48,63.5 4A.7 | 3A1.2 10.48,101.92 10.48,63.5 | 10.48,63.5 TP1.TP
N$29
  Top 0.406: TP3.TP 4A.9 20.32,61.91 17.78,64.45 17.78,86.36 3A2.8
N$35  (via drill 0.81)
  Top 0.406: v100.97,73.98 100.65,74.3 v100.65,85.72 | v71.44,86.04 71.44,95.89 73.66,98.11 3E.3
  Bottom 0.406: 4F.12 96.84,73.98 v100.97,73.98 | v100.65,85.72 100.33,86.04 v71.44,86.04
N$36  (via drill 0.81)
  Top 0.406: 4A.10 19.05,64.77 v19.05,77.15 | v27.62,81.6 28.89,82.87 28.89,103.5 v34.29,108.9 | v58.1,109.22 59.37,110.49 67.94,110.49 v67.94,91.44
  Bottom 0.406: v19.05,77.15 19.37,77.47 23.5,77.47 v27.62,81.6 | v34.29,108.9 51.44,108.9 51.75,108.58 57.47,108.58 v58.1,109.22 | 3E.6 v67.94,91.44
N$37  (via drill 0.81)
  Top 0.406: v6.35,75.25 6.35,37.47 7.94,35.88 v7.94,11.11 | v79.69,5.71 86.68,12.7 86.68,46.04 5F.3
  Bottom 0.406: 4A.15 20,75.88 13.97,75.88 13.02,74.93 9.84,74.93 9.53,75.25 v6.35,75.25 | v7.94,11.11 13.34,5.71 v79.69,5.71
N$38
  Top 0.406: 6A.6 11.43,16.51 11.43,49.53 5A.2
N$39
  Top 0.406: 4E.1 72.71,79.69 72.71,88.27 72.39,88.58 72.39,92.71 3E.5
N$40  (via drill 0.81)
  Top 0.406: v22.86,36.83 v22.86,22.86
  Bottom 0.406: v22.86,22.86 6A.14 | v22.86,36.83 21.59,38.1 5A.10
N$41  (via drill 0.81)
  Top 0.406: v10.16,35.56 v10.16,27.94
  Bottom 0.406: v10.16,27.94 6A.2 | 5A.7 v10.16,35.56
N$42
  Top 0.406: 6A.4 13.97,21.59 13.97,28.26 12.7,29.53 12.7,33.97 13.97,35.24 13.97,41.91 5A.5
N$43
  Top 0.406: 6A.10 21.59,13.97 21.59,49.53 5A.15
N$44
  Top 0.406: 6A.12 19.05,19.05 19.05,28.89 20.32,30.16 20.32,33.97 19.05,35.24 19.05,41.91 5A.12
N$45  (via drill 0.81)
  Top 0.406: 67.31,52.39 67.31,74.93 4D.15 | 6D.14 67.31,24.13 67.31,52.39 | 67.31,52.39 v66.99,52.07
  Bottom 0.406: 5D.2 58.74,51.12 64.77,51.12 65.72,52.07 v66.99,52.07
N$46  (via drill 0.81)
  Top 0.406: v61.59,27.94 63.5,29.84 63.5,38.1 5D.11 61.91,44.77 61.91,61.91 v63.5,63.5
  Bottom 0.406: 6D.2 60.96,27.94 v61.59,27.94 | v63.5,63.5 4D.10
N$47  (via drill 0.81)
  Top 0.406: 6D.6 60.33,17.14 60.33,28.57 60.96,29.21 60.96,40.64 59.69,41.91 | 5D.5 59.69,41.91 | v54.93,53.66 v54.93,63.18 | v56.52,52.07 57.15,51.44 57.15,47.94 58.1,46.99 59.69,46.99 59.69,41.91
  Bottom 0.406: 4D.7 58.1,63.18 v54.93,63.18 | v56.52,52.07 v54.93,53.66
N$48  (via drill 0.81)
  Top 0.406: 4D.1 61.91,78.74 61.91,84.77 62.23,85.09 | 3D.8 62.23,85.09 | TP5.TP 5B.1 | v60.96,86.36 62.23,85.09 | v36.83,86.36 32.38,81.92 32.38,56.83 32.07,56.52 v32.07,52.07
  Bottom 0.406: 5C.1 41.91,52.07 v32.07,52.07 29.21,52.07 5B.1 | v60.96,86.36 60.64,86.04 57.78,86.04 57.47,85.72 45.4,85.72 45.09,86.04 37.15,86.04 v36.83,86.36
N$50  (via drill 0.81)
  Top 0.406: v16.51,42.55 v16.51,71.44
  Bottom 0.406: 5C.10 49.53,39.37 21.59,39.37 5A.11 18.41,40.64 v16.51,42.55 | 4D.13 64.77,72.39 53.66,72.39 51.12,74.93 39.05,74.93 38.73,75.25 36.2,75.25 35.88,74.93 20,74.93 v16.51,71.44
N$51  (via drill 0.81)
  Top 0.406: v52.07,94.61 v52.07,72.07 | v8.26,92.71 7.62,92.08 v7.62,53.98
  Bottom 0.406: 13.02,48.58 13.97,49.53 40.32,49.53 41.59,50.8 5C.2 | 4D.5 55.56,68.58 v52.07,72.07 | v52.07,94.61 51.12,95.57 43.81,95.57 43.5,95.25 12.06,95.25 9.53,92.71 v8.26,92.71 | 13.02,48.58 v7.62,53.98 | 13.02,48.58 5A.3
N$52  (via drill 0.81)
  Top 0.406: v30.16,3.17 40.64,13.65 40.64,35.56 5C.7 | v55.88,69.85 56.2,69.53 56.2,53.34 53.98,51.12 53.98,40.32 v54.29,40.01
  Bottom 0.406: 5A.6 9.84,37.78 4.13,37.78 1.59,35.24 1.59,9.53 8.26,9.53 14.61,3.17 v30.16,3.17 | 4D.12 60.01,68.58 58.74,69.85 v55.88,69.85 | v54.29,40.01 51.12,36.83 44.77,36.83 43.5,38.1 5C.7
N$53  (via drill 0.81)
  Top 0.406: 6B.14 36.83,24.13 36.83,32.7 34.29,35.24 34.29,35.88 35.56,37.15 5B.10 | v30.48,38.1 v30.48,44.45 | v40.32,48.26 39.05,46.99 v39.05,38.1
  Bottom 0.406: 5A.4 13.34,45.09 19.37,45.09 20,44.45 v30.48,44.45 | v30.48,38.1 5B.10 v39.05,38.1 | 5D.3 58.1,48.58 52.07,48.58 51.12,49.53 41.59,49.53 v40.32,48.26
N$54  (via drill 0.81)
  Top 0.406: 5B.2 25.72,48.58 | 6B.6 25.72,15.24 v25.72,32.7 25.72,48.58 | 25.72,48.58 v25.4,48.26
  Bottom 0.406: v25.4,48.26 5A.14 | 5D.6 57.15,39.37 57.15,36.83 58.74,36.83 59.69,35.88 59.69,32.7 42.55,32.7 42.23,32.38 30.16,32.38 29.84,32.7 v25.72,32.7
N$55  (via drill 0.81)
  Top 0.406: v24.45,27.94 v24.45,34.61 v24.45,41.91 v24.45,45.72
  Bottom 0.406: 6B.2 25.4,27.94 v24.45,27.94 | 5B.7 v24.45,34.61 | v24.45,45.72 5A.13 | 5D.10 63.18,40.96 59.69,40.96 58.74,41.91 v24.45,41.91
N$59  (via drill 0.81)
  Top 0.406: v59.37,102.87 63.82,98.42 63.82,93.66 3D.9
  Bottom 0.406: 5A.9 20,35.88 19.05,35.88 13.02,41.91 12.38,41.91 1.59,52.7 1.59,99.38 8.89,99.38 12.38,102.87 54.93,102.87 55.24,103.19 57.78,103.19 58.1,102.87 v59.37,102.87
N$61  (via drill 0.81)
  Top 0.406: v90.17,61.28 91.44,62.55 v91.44,77.47 91.44,107.95 88.9,107.95 84.14,103.19 84.14,102.87 80.96,102.87 80.01,101.92 80.01,100.33 3E.12
  Bottom 0.406: 4D.9 76.83,60.96 77.15,61.28 v90.17,61.28 | v91.44,77.47 90.17,78.74 4F.1
N$70
  Bottom 0.406: 3E.8 80.01,90.17 80.01,92.71 87.63,92.71 3F.5
N$71  (via drill 0.81)
  Top 0.406: v92.71,96.52 v92.71,76.2
  Bottom 0.406: v92.71,76.2 4F.2 | 3F.4 v92.71,96.52
N$72
  Top 0.406: 3B.2 3B.3
N$74
  Bottom 0.406: 3B.4 35.88,96.84 41.91,96.84 42.86,97.79 54.93,97.79 55.24,98.11 57.78,98.11 58.1,97.79 64.77,97.79 3D.11
RDF  (via drill 0.81)
  Top 0.406: 4A.6 11.43,67.31 11.43,100.33 3A1.3 | 6B.15 32.7,22.54 32.7,11.11 24.77,3.17 9.53,3.17 9.53,6.99 6.03,10.48 1.59,10.48 1.59,59.05 v2.86,60.33
  Bottom 0.406: v2.86,60.33 8.57,66.04 4A.6
RIF  (via drill 0.81)
  Top 0.406: v9.21,93.98 9.53,93.66 9.53,74.3 v9.21,73.98 8.57,73.34 8.57,62.87 8.89,62.55 8.89,12.38 v12.7,8.57 | 6D.15 64.77,24.13 64.77,14.92 58.42,8.57 v50.8,8.57
  Bottom 0.406: 4A.4 9.84,73.98 v9.21,73.98 | v9.21,93.98 11.75,96.52 3A1.5 | v50.8,8.57 48.9,6.67 14.61,6.67 v12.7,8.57
RMEN  (via drill 0.81)
  Top 0.406: 3A1.8 4A.1 | v73.66,36.51 6E.1 | v39.37,87.63 41.91,85.09 v41.91,77.47 | v59.37,77.47 60.01,76.83 60.01,58.42 60.96,57.47 v60.96,43.18
  Bottom 0.406: v73.66,36.51 76.52,39.37 76.52,40.64 | 5E.9 76.52,40.64 | 3A1.8 13.02,88.58 19.05,88.58 20.64,87 35.88,87 36.51,87.63 v39.37,87.63 | v59.37,77.47 v41.91,77.47 | v60.96,43.18 62.23,41.91 74.61,41.91 75.88,40.64 76.52,40.64
SELIR  (via drill 0.81)
  Top 0.406: v18.73,43.81 19.05,44.13 19.05,51.12 20,52.07 22.23,52.07 v22.23,57.15 | v26.04,88.27 26.35,87.95 26.35,71.12 27.62,69.85 29.21,69.85 v29.21,62.23
  Bottom 0.406: 6C.15 46.99,29.21 32.07,29.21 29.53,31.75 26.35,31.75 26.04,31.43 25.4,31.43 21.59,35.24 21.59,36.83 20,36.83 15.24,41.59 15.24,43.81 v18.73,43.81 | v22.23,57.15 27.3,62.23 v29.21,62.23 34.29,62.23 4B.9 | 3A2.7 23.5,88.27 v26.04,88.27
VCC  (via drill 0.81)
  Top 0.406: 4C.16 49.53,80.01 C9.1 | 4A.16 19.05,80.01 C7.1 | C8.1 34.29,80.01 4B.16 33.34,76.52 33.34,69.22 35.24,67.31 37.15,67.31 37.15,63.18 37.78,62.55 37.78,55.88 35.56,53.66 5B.16 | C12.1 95.89,80.64 95.89,79.38 4F.14 | C11.1 81.28,80.01 4E.14 | v61.28,71.12 63.82,73.66 63.82,80.33 C10.1 | 3A2.1 3A1.1 | C5.1 81.28,105.41 3E.14 | C6.1 96.52,105.41 3F.14 | 3D.10 64.77,95.25 64.77,97.79 3D.12 64.77,100.33 64.77,104.14 | C3.1 41.91,105.41 3B.14 39.37,100.33 39.37,91.12 42.86,87.63 42.86,79.06 4C.1 | 3D.14 64.77,104.14 | 64.77,104.14 3D.1 | 64.77,104.14 C4.1 | C13.1 20.32,54.61 5A.16 | 5B.13 38.1,45.72 v38.1,53.34 | v55.24,49.85 v55.24,45.72 | 6E.16 81.28,29.21 C23.1 82.55,33.02 82.55,52.07 5E.14 | 6F.3 87.63,24.13 87.63,26.67 | 6F.1 87.63,26.67 | 87.63,26.67 87.63,44.45 5F.4 90.17,46.99 90.17,52.7 v90.81,53.34 | C21.1 50.8,29.21 6C.16 | C22.1 66.04,29.21 6D.16 | C20.1 35.56,29.21 6B.16
  Bottom 0.406: 4B.16 4C.1 4C.16 52.07,80.01 66.04,80.01 | 4A.16 24.45,82.87 29.53,82.87 31.11,81.28 C8.1 | PL1.1 C12.1 93.98,82.55 78.74,82.55 | v61.28,71.12 4D.4 | 66.04,81.28 66.04,80.01 | 66.04,80.01 4D.16 | C10.1 66.04,81.28 | 78.74,82.55 C11.1 | 78.74,82.55 72.71,82.55 71.44,81.28 66.04,81.28 | 3A1.1 7.62,101.6 C2.+ | C6.1 93.98,107.95 81.28,107.95 C5.1 78.74,107.95 74.61,107.95 73.34,106.68 C4.1 | 3D.1 3B.14 | 3A2.1 21.27,107.63 36.2,107.63 36.51,107.95 40.64,107.95 C3.1 | 5A.1 5A.16 21.91,54.93 28.57,54.93 28.89,54.61 35.56,54.61 | 5B.16 36.83,53.34 | 36.83,53.34 v38.1,53.34 39.37,54.61 49.53,54.61 | 36.83,53.34 35.56,54.61 | 35.56,54.61 C14.1 | C17.1 80.01,53.34 5E.14 | C18.1 93.98,57.15 89.85,57.15 88.58,55.88 C17.1 | 64.77,53.34 C16.1 73.34,55.88 74.61,57.15 78.74,57.15 C17.1 | 5D.16 64.77,53.34 | v55.24,45.72 5C.13 | 49.53,54.61 49.53,53.34 5C.16 51.75,53.34 v55.24,49.85 55.88,49.85 58.1,52.07 63.5,52.07 64.77,53.34 | 49.53,54.61 C15.1 | 95.25,27.94 C24.1 112.39,30.48 112.39,32.07 111.44,33.02 PL1.40 | 6F.16 95.25,27.94 | v90.81,53.34 5F.14 | 6E.16 6F.1 95.25,27.94 | 6C.16 54.61,31.75 62.55,31.75 63.82,30.48 C22.1 | 19.05,29.21 19.05,27.94 6A.16 | 19.05,29.21 C19.1 17.78,31.75 8.89,31.75 C1.+ | 6B.16 35.24,28.26 29.21,28.26 28.26,29.21 19.05,29.21 | C21.1 48.26,31.75 42.86,31.75 41.59,30.48 C20.1 | C23.1 78.74,31.75 73.66,31.75 69.85,27.94 6D.16
XTA
  Top 0.406: 3F.13 TP12.TP 99.06,109.54 100.97,109.54 101.92,108.58 101.92,100.65 107.63,94.93 107.63,89.85 107.95,89.53 107.95,77.47 PL1.6
XTC
  Bottom 0.406: 3B.5 36.83,92.71 44.77,92.71 49.85,87.63 67.63,87.63 68.26,87 70.8,87 71.12,87.31 77.79,87.31 78.11,87 104.14,87 108.9,82.23 108.9,72.39 103.5,72.39 102.87,73.03 102.87,76.2 PL1.5

### Text on the board
Bottom: EMC6907 MMU